# Altium schematic sheet M16+ EX.SchDoc
size A4; PageSetup: Record=PageOptions|CenterHorizontal=True|CenterVertical=True|PrintScale=0.98|XCorrection=1.00|YCorrection=1.00|PrintKind=0|BorderSize=5000000|LeftOffset=0|BottomOffset=0|Orientation=2|PaperLength=1000|PaperWidth=1000|Scale=100|PaperSource=7|PrintQuality=-4|MediaType=1|DitherType=10|PaperKind=A4|PrintScaleMode=1
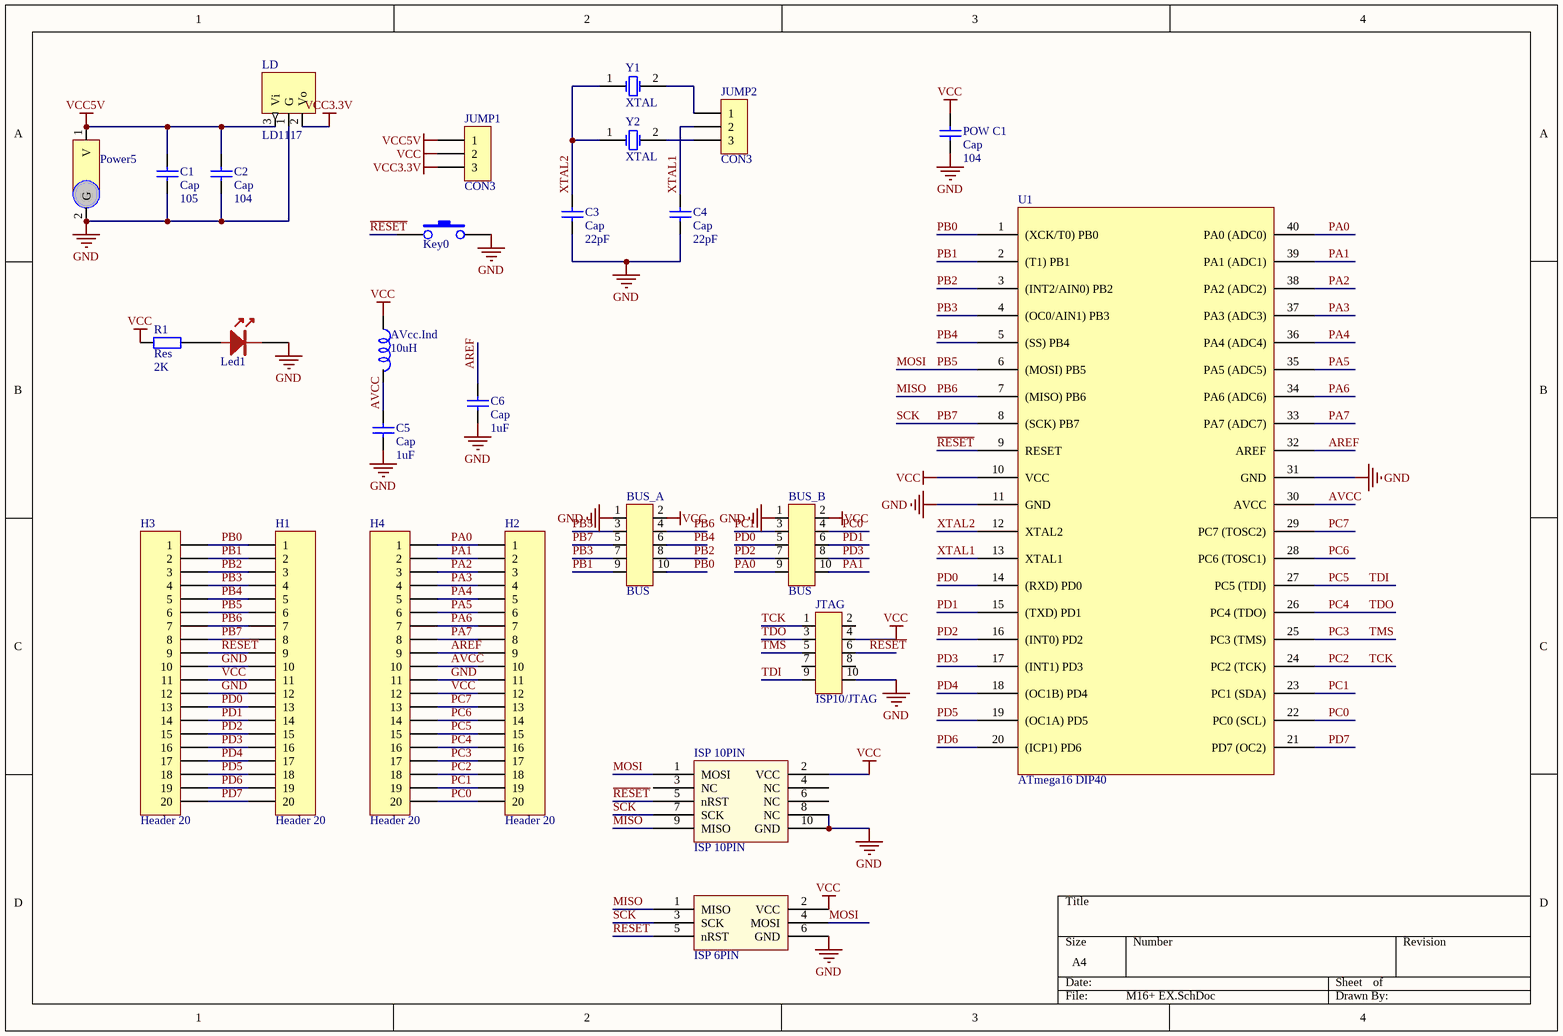
[diagram p0: M16+ EX.SchDoc]

## Parts
AVcc.Ind  10uH  [RES]
BUS_A  BUS  [ISP_10]
BUS_B  BUS  [ISP_10]
C1  Cap  value 105  [0805]
C2  Cap  value 104  [0805]
C3  Cap  value 22pF  [0603]
C4  Cap  value 22pF  [0603]
C5  Cap  value 1uF  [0805]
C6  Cap  value 1uF  [0805]
H1  Header 20  [SIP20]
H2  Header 20  [SIP20]
H3  Header 20  [SIP20]
H4  Header 20  [SIP20]
ISP_6PIN  ISP 6PIN  [ISP_6]  (value not drawn)
ISP_10PIN  ISP 10PIN  [ISP_10]
JTAG  ISP10/JTAG  [ISP_10]
JUMP1  CON3  [SIP3]
JUMP2  CON3  [SIP3]
Key0  PB2  [KEY]  (value not drawn)
LD  LD1117  [LD1117-3.3]
Led1  Led1  [0805_LED]  (value not drawn)
POW_C1  Cap  value 104  [0805]
Power5  5V  [PWR_5V]  (value not drawn)
R1  Res  value 2K  [0603]
U1  ATmega16 DIP40  [DIP40 3M]
Y1  XTAL  [CRYSTAL]
Y2  XTAL  [CRYSTAL2]

## Nets
GND: BUS_A.1 BUS_B.1 C1.1 C2.1 C3.1 C4.1 C5.1 C6.1 H1.10 H1.12 H2.11 H3.10 H3.12 H4.11 ISP_6PIN.6(GND) ISP_10PIN.8(NC) ISP_10PIN.10(GND) JTAG.10 Key0.2 LD.1(G) Led1.2 POW_C1.1 Power5.2(G) U1.11(GND) U1.31(GND)
VCC: AVcc.Ind.1 BUS_A.2 BUS_B.2 H1.11 H2.12 H3.11 H4.12 ISP_6PIN.2(VCC) ISP_10PIN.2(VCC) JTAG.4 JUMP1.2 POW_C1.2 R1.2 U1.10(VCC)
VCC3.3V: JUMP1.3 LD.2(Vo)
VCC5V: C1.2 C2.2 JUMP1.1 LD.3(Vi) Power5.1(V)
AREF: C6.2 H2.9 H4.9 U1.32(AREF)
AVCC: AVcc.Ind.2 C5.2 H2.10 H4.10 U1.30(AVCC)
MISO: BUS_A.4 H1.7 H3.7 ISP_6PIN.1(MISO) ISP_10PIN.9(MISO) U1.7((MISO)_PB6)  [also labelled PB6]
MOSI: BUS_A.3 H1.6 H3.6 ISP_6PIN.4(MOSI) ISP_10PIN.1(MOSI) U1.6((MOSI)_PB5)  [also labelled PB5]
PA0: BUS_B.9 H2.1 H4.1 U1.40(PA0_(ADC0))
PA1: BUS_B.10 H2.2 H4.2 U1.39(PA1_(ADC1))
PA2: H2.3 H4.3 U1.38(PA2_(ADC2))
PA3: H2.4 H4.4 U1.37(PA3_(ADC3))
PA4: H2.5 H4.5 U1.36(PA4_(ADC4))
PA5: H2.6 H4.6 U1.35(PA5_(ADC5))
PA6: H2.7 H4.7 U1.34(PA6_(ADC6))
PA7: H2.8 H4.8 U1.33(PA7_(ADC7))
PB0: BUS_A.10 H1.1 H3.1 U1.1((XCK/T0)_PB0)
PB1: BUS_A.9 H1.2 H3.2 U1.2((T1)_PB1)
PB2: BUS_A.8 H1.3 H3.3 U1.3((INT2/AIN0)_PB2)
PB3: BUS_A.7 H1.4 H3.4 U1.4((OC0/AIN1)_PB3)
PB4: BUS_A.6 H1.5 H3.5 U1.5((SS)_PB4)
PB7: BUS_A.5 H1.8 H3.8 ISP_6PIN.3(SCK) ISP_10PIN.7(SCK) U1.8((SCK)_PB7)  [also labelled SCK]
PC0: BUS_B.4 H2.20 H4.20 U1.22(PC0_(SCL))
PC1: BUS_B.3 H2.19 H4.19 U1.23(PC1_(SDA))
PC2: H2.18 H4.18 JTAG.1 U1.24(PC2_(TCK))  [also labelled TCK]
PC3: H2.17 H4.17 JTAG.5 U1.25(PC3_(TMS))  [also labelled TMS]
PC4: H2.16 H4.16 JTAG.3 U1.26(PC4_(TDO))  [also labelled TDO]
PC5: H2.15 H4.15 JTAG.9 U1.27(PC5_(TDI))  [also labelled TDI]
PC6: H2.14 H4.14 U1.28(PC6_(TOSC1))
PC7: H2.13 H4.13 U1.29(PC7_(TOSC2))
PD0: BUS_B.5 H1.13 H3.13 U1.14((RXD)_PD0)
PD1: BUS_B.6 H1.14 H3.14 U1.15((TXD)_PD1)
PD2: BUS_B.7 H1.15 H3.15 U1.16((INT0)_PD2)
PD3: BUS_B.8 H1.16 H3.16 U1.17((INT1)_PD3)
PD4: H1.17 H3.17 U1.18((OC1B)_PD4)
PD5: H1.18 H3.18 U1.19((OC1A)_PD5)
PD6: H1.19 H3.19 U1.20((ICP1)_PD6)
PD7: H1.20 H3.20 U1.21(PD7_(OC2))
~{RESET}: H1.9 H3.9 ISP_6PIN.5(nRST) ISP_10PIN.5(nRST) JTAG.6 Key0.1 U1.9(RESET)
XTAL1: C4.2 JUMP2.2 U1.13(XTAL1)
XTAL2: C3.2 U1.12(XTAL2) Y1.1(OSC1) Y2.1(OSC1)
NetJUMP2_1: JUMP2.1 Y1.2(OSC2)
NetJUMP2_3: JUMP2.3 Y2.2(OSC2)
NetLed1_1: Led1.1 R1.1

Not connected (* = marked no-connect by the designer): ISP_10PIN 3(NC) 4(NC) 6(NC); JTAG 2 7 8

## Library data of the parts
AVcc.Ind = IND
BUS_A BUS_B JTAG = ISP_10
C1-C6 POW_C1 = Cap: Capacitor; Published: 8-Jun-2000; LatestRevisionDate: 17-Jul-2002; LatestRevisionNote: Re-released for DXP Platform.; PackageReference: RAD-0.3; Publisher: Altium Limited
H1-H4 = Header 20: Header, 20-Pin; LatestRevisionDate: 17-Jul-2002; LatestRevisionNote: Re-released for DXP Platform.; Publisher: Altium Limited
JUMP1 JUMP2 = CON3: Connector
Key0 = KEY
Led1 = LED
Power5 = Power5
R1 = Res2: Resistor; Published: 8-Jun-2000; LatestRevisionDate: 17-Jul-2002; LatestRevisionNote: Re-released for DXP Platform.; PackageReference: AXIAL-0.4; Publisher: Altium Limited
Y1 Y2 = XTAL: Crystal Oscillator; Published: 8-Jun-2000; LatestRevisionDate: 17-Jul-2002; LatestRevisionNote: Re-released for DXP Platform.; PackageReference: R38; Publisher: Altium Limited